# Altium schematic sheet nfc-epd-afe.SchDoc
size Letter
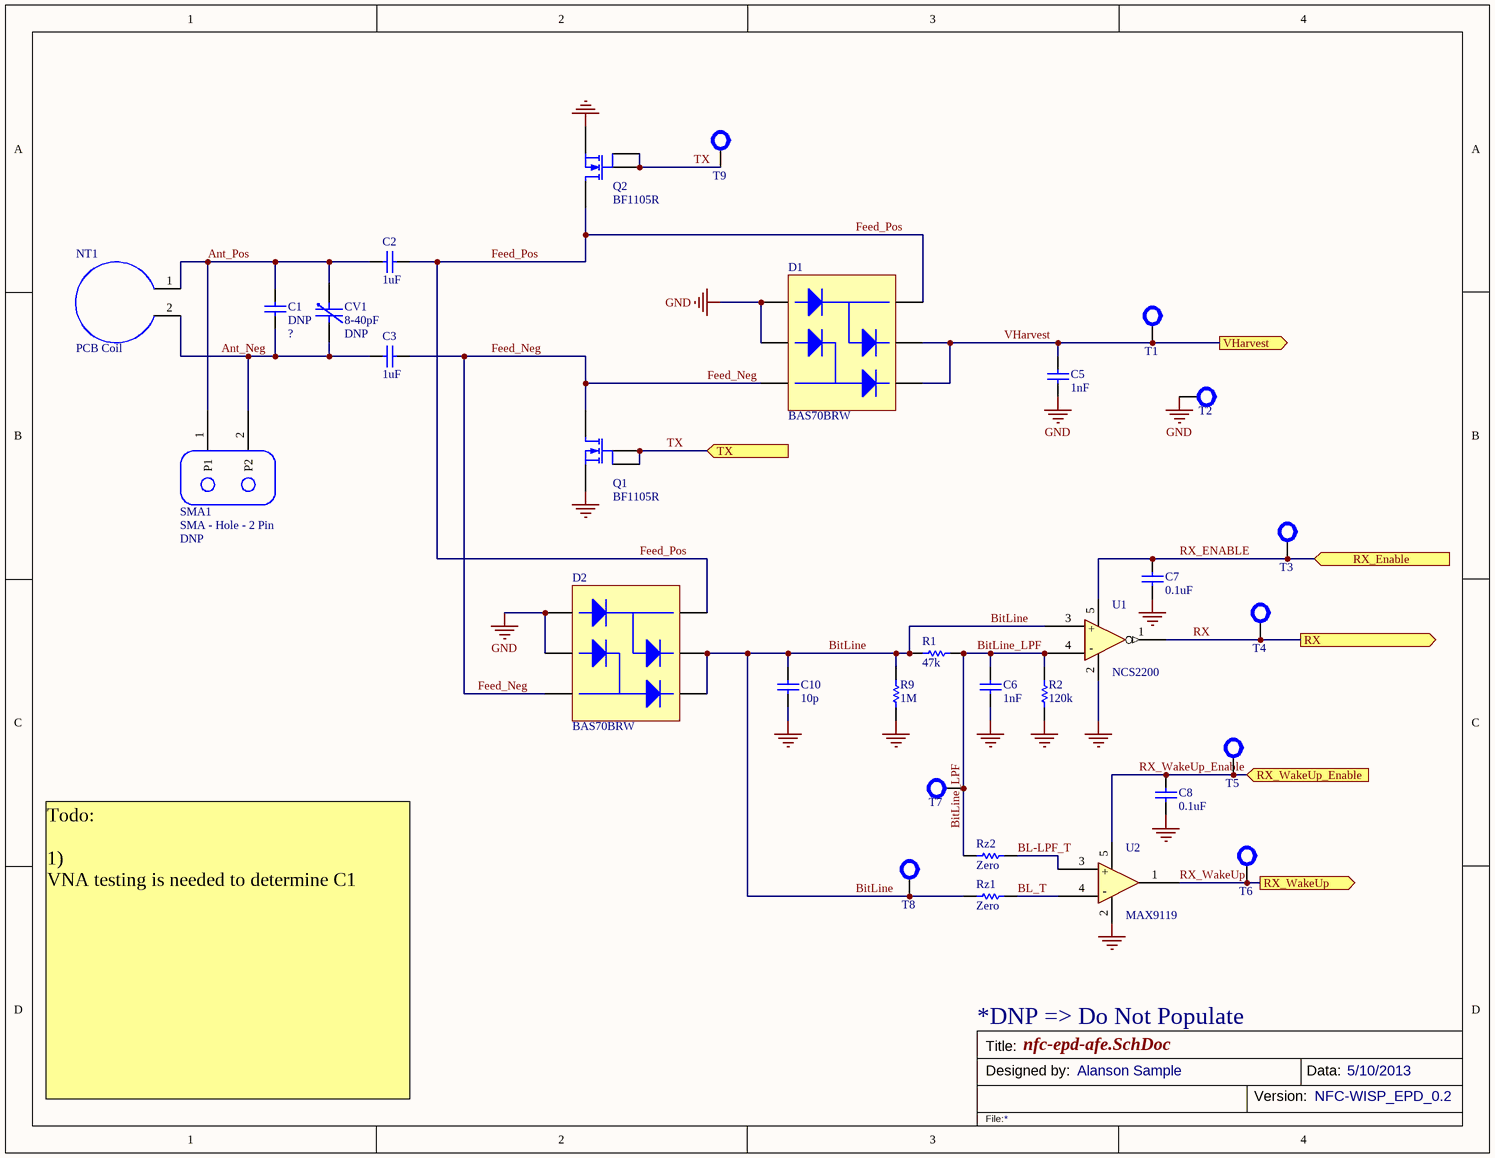
[diagram p0: nfc-epd-afe.SchDoc]

## Parts
C1  Note: DNP  [0603]  (hidden comment: Cap)
C2  value 1uF  [0603]  (hidden comment: Cap)
C3  value 1uF  [0603]  (hidden comment: Cap)
C5  value 1nF  [0603]  (hidden comment: Cap)
C6  value 1nF  [0603]  (hidden comment: Cap)
C7  value 0.1uF  [0603]  (hidden comment: Cap)
C8  value 0.1uF  [0603]  (hidden comment: Cap)
C10  value 10p  [0603]  (hidden comment: Cap)
CV1  value 8-40pF  Notes: DNP  [Var-Cap - GKY40056]  (hidden comment: GKY40056)
D1  BAS70BRW  [SOT-363]
D2  BAS70BRW  [SOT-363]
NT1  PCB Coil  [Net Tie - 50mil]  (net tie, no BOM)
Q1  BF1105R  [SOT-143R]
Q2  BF1105R  [SOT-143R]
R1  value 47k  [0603]  (hidden comment: Res)
R2  value 120k  [0603]  (hidden comment: Res)
R9  value 1M  [0603]  (hidden comment: Res)
Rz1  value Zero  [0603]  (hidden comment: Res)
Rz2  value Zero  [0603]  (hidden comment: Res)
SMA1  SMA - Hole - 2 Pin  Note: DNP  [SMA - Hole - 2 Pin]
T1  Test Point  [Test Point - Small]  (value not drawn)
T2  Test Point  [Test Point - Small]  (value not drawn)
T3  Test Point  [Test Point - Small]  (value not drawn)
T4  Test Point  [Test Point - Small]  (value not drawn)
T5  Test Point  [Test Point - Small]  (value not drawn)
T6  Test Point  [Test Point - Small]  (value not drawn)
T7  Test Point  [Test Point - Small]  (value not drawn)
T8  Test Point  [Test Point - Small]  (value not drawn)
T9  Test Point  [Test Point - Small]  (value not drawn)
U1  NCS2200  [SC70-5]
U2  MAX9119  [SC70-5]

## Ports
RX (out), RX_Enable (in), RX_WakeUp (out), RX_WakeUp_Enable (in), TX (in), VHarvest (out)

## Nets
GND: C5.2 C6.2 C7.2 C8.2 C10.2 D1.1(A1) D1.2(A2) D2.1(A1) D2.2(A2) Q1.1(S) Q2.1(S) R2.2 R9.2 T2.0 U1.2(Gnd) U2.2(VEE)
Ant_Neg: C1.2 C3.1 CV1.2 NT1.2(N2) SMA1.2(P2)
Ant_Pos: C1.1 C2.1 CV1.1 NT1.1(N1) SMA1.1(P1)
BitLine: C10.1 D2.4(C2) D2.5(C1) R1.1 R9.1 Rz1.1 T8.0 U1.3(IN+)
BitLine_LPF: C6.1 R1.2 R2.1 Rz2.1 T7.0 U1.4(In-)
BL-LPF_T: Rz2.2 U2.3(IN+)
BL_T: Rz1.2 U2.4(In-)
Feed_Neg: C3.2 D1.3(AC2) D2.3(AC2) Q1.2(D)
Feed_Pos: C2.2 D1.6(AC1) D2.6(AC1) Q2.2(D)
RX: T4.0 U1.1(OUT) ; port RX
RX_ENABLE: C7.1 T3.0 U1.5(VDD) ; port RX_Enable
RX_WakeUp: T6.0 U2.1(OUT) ; port RX_WakeUp
RX_WakeUp_Enable: C8.1 T5.0 U2.5(VCC) ; port RX_WakeUp_Enable
TX: Q1.3(G) Q1.4(G) Q2.3(G) Q2.4(G) T9.0 ; port TX
VHarvest: C5.1 D1.4(C2) D1.5(C1) T1.0 ; port VHarvest

## Notes on the sheet
- *DNP => Do Not Populate
- Todo:
  1)
  VNA testing is needed to determine C1
- Title:
- Designed by:
- Alanson Sample
- Version:
- Data:
- NFC-WISP_EPD_0.2
- 5/10/2013
- File:
- (in symbol MAX9119) +; -
- (in symbol NCS2200) +; -

## Library data of the parts
C1-C3 C5-C8 C10 = Cap: Ceramic Capacitor (Surface Mount); Manufacturer: Generic Ceramic Chip Cap (TBD); Digi-Key Part Number: *; Manufacturer Part Number: *; Rating: *
  C1: Value: ?
  C2 C3 C5-C8 C10: Note: *
CV1 = Var-Cap/603: Var-Cap Sprague-Goodman GKY40056; Digi-Key Part Number: SG9013CT-ND; Manufacturer Part Number: GKY40056; Manufacturer: Sprague-Goodman; Rating: *
D1 D2 = Diode - Array_2: Diode Array - 2 Pair Series Connection; Manufacturer: Diodes Inc; Manufacturer Part Number: BAS70BRW-7-F; Note: *; Digi-Key Part Number: BAS70BRW-7FDICT-ND; Value: *; Rating: *
NT1 = Net Tie - Coil: Hand draw coil symbol based on a 'Net Tie'; Note: A Net Tie is an element that allows two differnt nets to be connected (shorted) together.
Q1 Q2 = BF1105R: SOT-143R, N-Channel Dual-Gate Mos-Fets MOSFET; Manufacturer Part Number: BF1105R,215; Manufacturer: NXP Semiconductors; Digi-Key Part Number: BF1105R,215-ND; Rating: *; Value: *; Note: *
R1 R2 R9 Rz1 Rz2 = Res: Chip Resistor (Surface Mount); Manufacturer: Generic Chip Res (TBD); Manufacturer Part Number: *; Digi-Key Part Number: *; Rating: *
SMA1 = SMA - Hole - 2 Pin: Two pin SMA connector wisp
T1-T9 = Test Point: Test Point, large or small foot prints; Manufacturer Part Number: Example: 5000, 5013; Manufacturer: Keystone Electronics; Digi-Key Part Number: Example: 5000K-ND, 5012K-ND, Surface mount 5015KCT-ND; Note: *; Rating: *; Value: *
U1 = NCS2200: Comparator: On Semi 10uA Comparator; Manufacturer: ON Semiconductor; Manufacturer Part Number: NCS2200SQ2T2G; Digi-Key Part Number: NCS2200SQ2T2GOSTR-ND; Rating: *; Value: *; Note: *
U2 = MAX9119: IC COMPARATOR BTR SC70-5, 350nA; Manufacturer: Maxim Integrated; Manufacturer Part Number: MAX9119EXK+T; Digi-Key Part Number: MAX9119EXK+TCT-ND; Rating: *; Value: *; Note: *